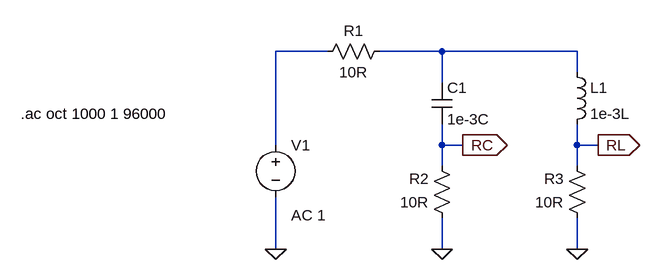
[diagram p0: schematic parallel_RC_RL.asc]
parallel_RC_RL.asc, the LTspice schematic file:
Version 4
SHEET 1 880 680
WIRE -576 48 -656 48
WIRE -400 48 -496 48
WIRE -192 48 -400 48
WIRE -192 80 -192 48
WIRE -400 96 -400 48
WIRE -656 192 -656 48
WIRE -400 192 -400 160
WIRE -368 192 -400 192
WIRE -192 192 -192 160
WIRE -160 192 -192 192
WIRE -400 224 -400 192
WIRE -192 224 -192 192
WIRE -656 352 -656 272
WIRE -400 352 -400 304
WIRE -192 352 -192 304
FLAG -656 352 0
FLAG -400 352 0
FLAG -192 352 0
FLAG -368 192 RC
IOPIN -368 192 Out
FLAG -160 192 RL
IOPIN -160 192 Out
SYMBOL voltage -656 176 R0
WINDOW 123 24 124 Left 2
WINDOW 39 24 152 Left 2
SYMATTR Value2 AC 1
SYMATTR InstName V1
SYMATTR Value ""
SYMBOL res -480 32 R90
WINDOW 0 0 56 VBottom 2
WINDOW 3 32 56 VTop 2
SYMATTR InstName R1
SYMATTR Value 10R
SYMBOL res -384 320 R180
WINDOW 0 36 76 Left 2
WINDOW 3 36 40 Left 2
SYMATTR InstName R2
SYMATTR Value 10R
SYMBOL res -176 320 R180
WINDOW 0 36 76 Left 2
WINDOW 3 36 40 Left 2
SYMATTR InstName R3
SYMATTR Value 10R
SYMBOL cap -416 96 R0
SYMATTR InstName C1
SYMATTR Value 1e-3C
SYMBOL ind -208 64 R0
SYMATTR InstName L1
SYMATTR Value 1e-3L
TEXT -1048 144 Left 2 !.ac oct 1000 1 96000

The netlist it stands for:
* parallel_RC_RL.asc
V1 N001 0 AC 1
R1 N002 N001 10R
R2 0 RC 10R
R3 0 RL 10R
C1 N002 RC 1e-3C
L1 N002 RL 1e-3L
.ac oct 1000 1 96000
.backanno
.end